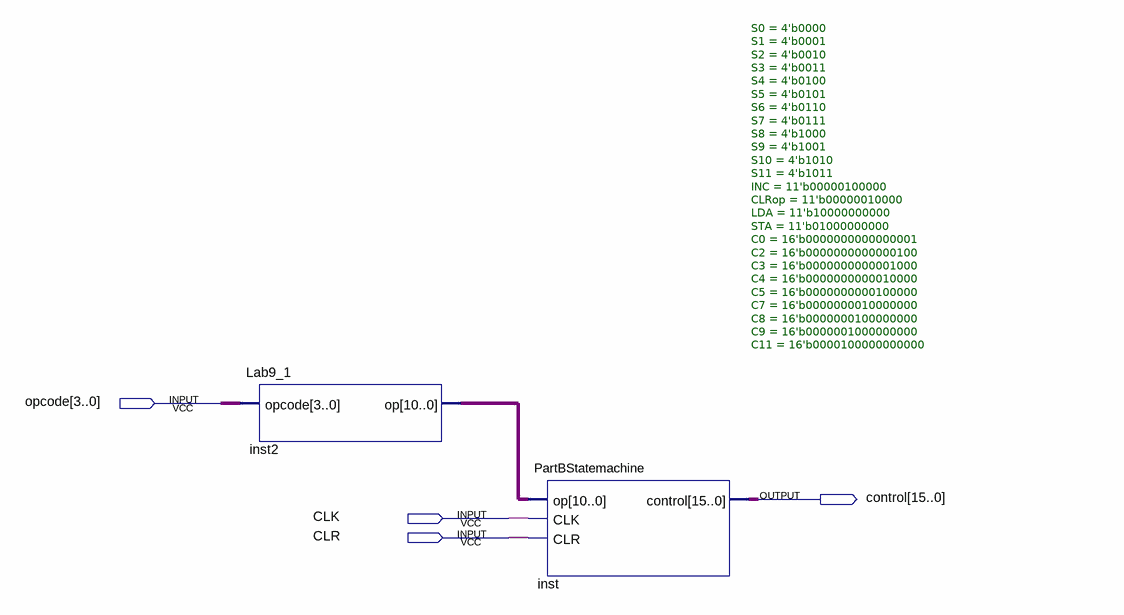
[diagram p0: schematic sheet]
// Quartus schematic PartBController.bdf as structural Verilog: 2 symbols, 4 pins
module PartBController (
  input  [3:0] opcode,
  input  CLK,
  input  CLR,
  output [15:0] control
);

  wire [10:0] inst2_op;

  Lab9_1 inst2 (.opcode(opcode), .op(inst2_op));
  PartBStatemachine #(.S0(4'b0000), .S1(4'b0001), .S2(4'b0010), .S3(4'b0011), .S4(4'b0100), .S5(4'b0101), .S6(4'b0110), .S7(4'b0111), .S8(4'b1000), .S9(4'b1001), .S10(4'b1010), .S11(4'b1011), .INC(11'b00000100000), .CLRop(11'b00000010000), .LDA(11'b10000000000), .STA(11'b01000000000), .C0(16'b0000000000000001), .C2(16'b0000000000000100), .C3(16'b0000000000001000), .C4(16'b0000000000010000), .C5(16'b0000000000100000), .C7(16'b0000000010000000), .C8(16'b0000000100000000), .C9(16'b0000001000000000), .C11(16'b0000100000000000)) inst (
    .op(inst2_op), .CLK(CLK), .CLR(CLR), .control(control));
endmodule
